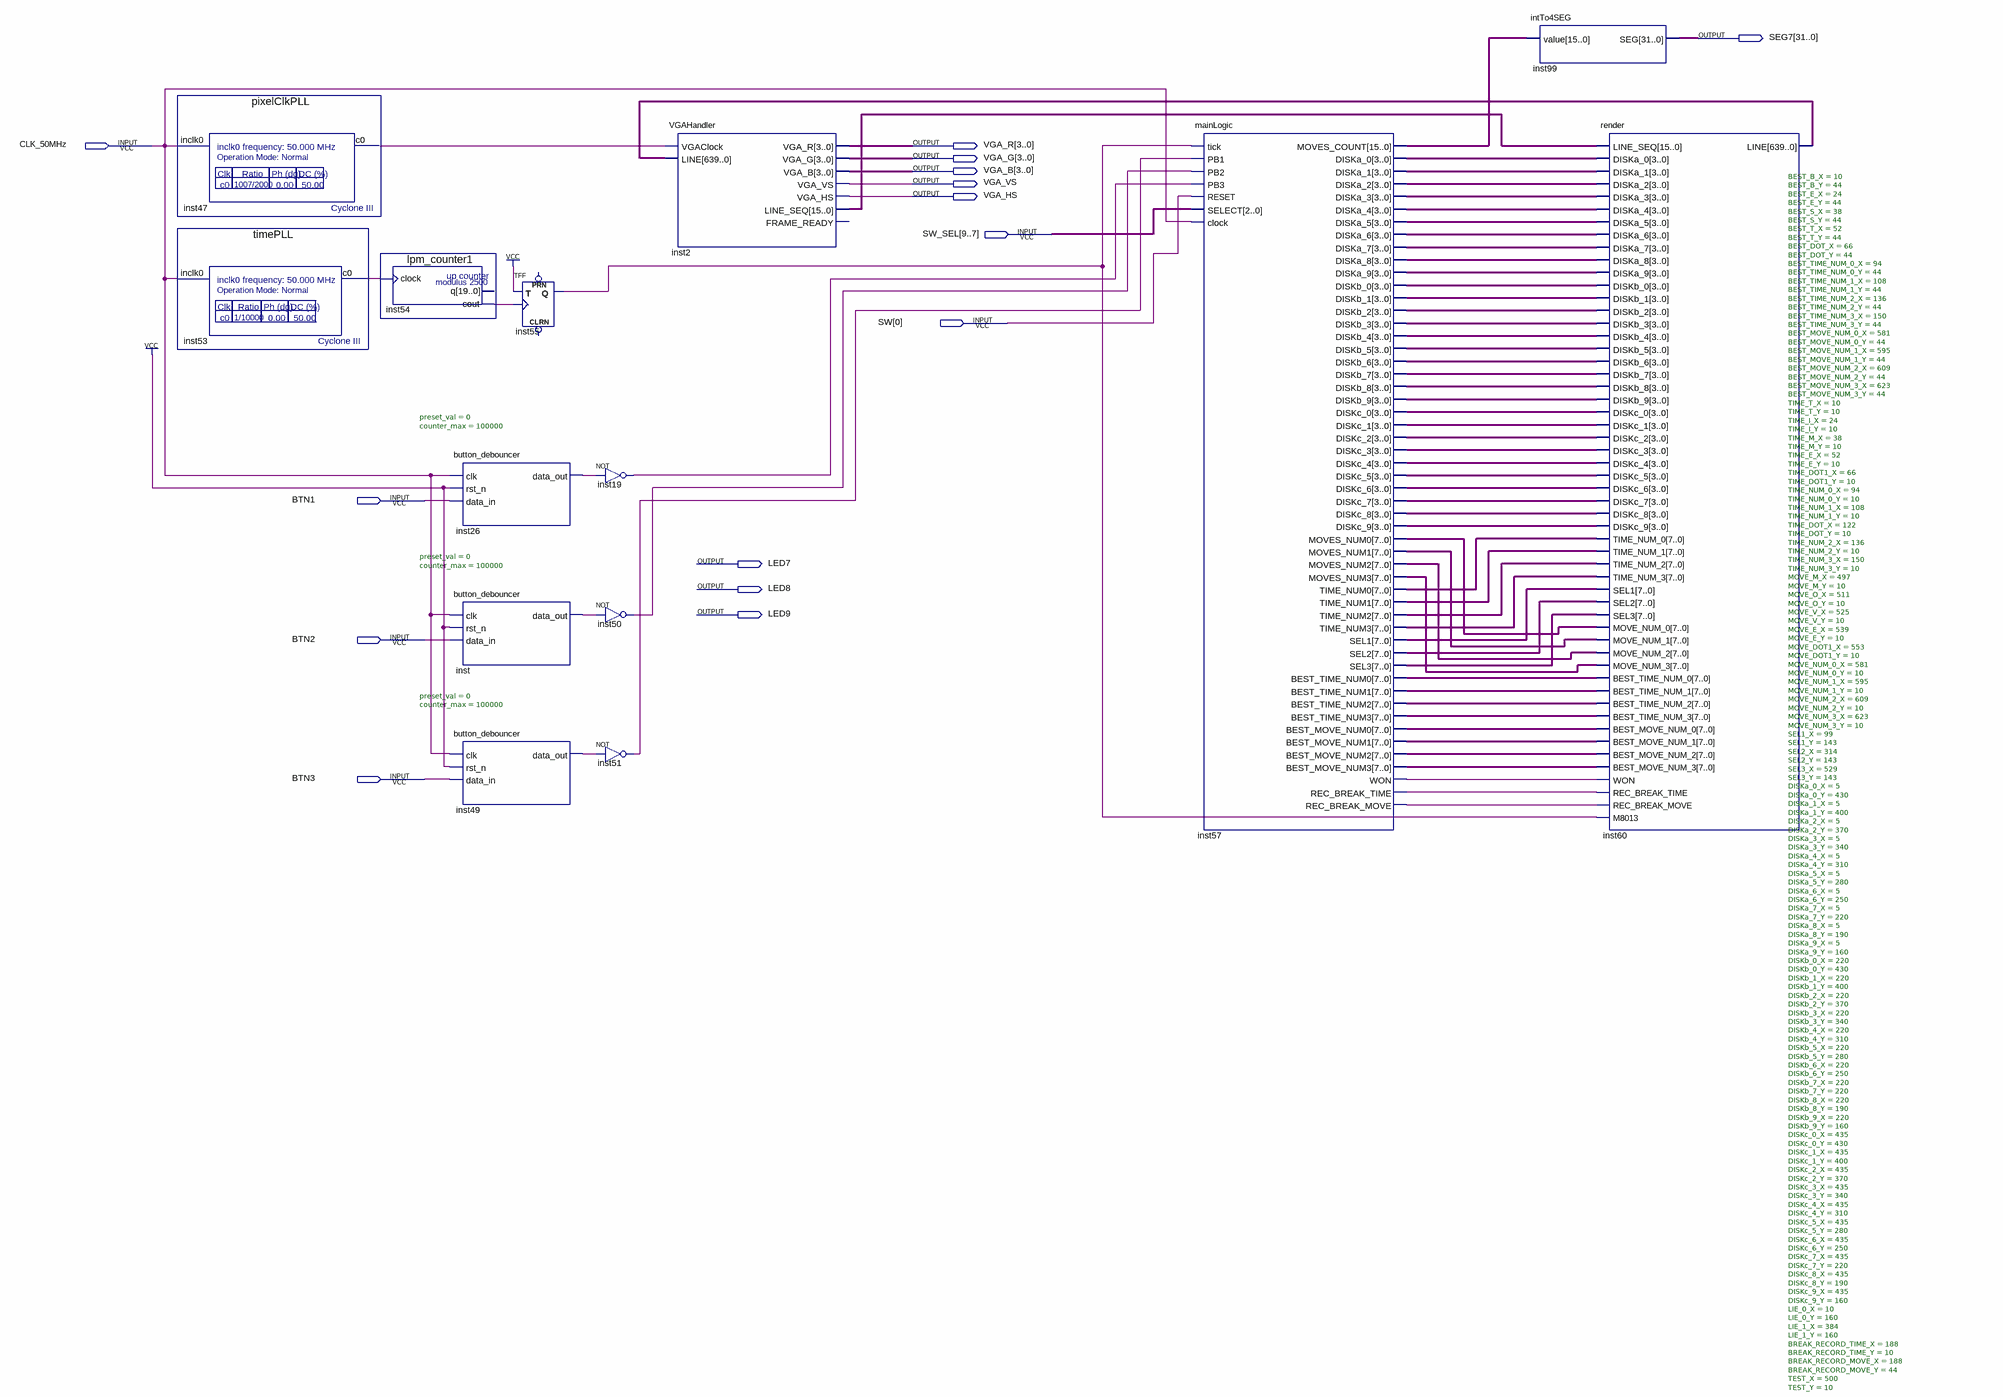
[diagram p0: schematic sheet]
// Quartus schematic main.bdf as structural Verilog: 14 symbols, 15 pins
module main (
  input  CLK_50MHz,
  input  [9:7] SW_SEL,
  input  [0:0] SW,
  input  BTN1,
  input  BTN2,
  input  BTN3,
  output [31:0] SEG7,
  output [3:0] VGA_R,
  output [3:0] VGA_G,
  output [3:0] VGA_B,
  output VGA_VS,
  output VGA_HS,
  output LED7,
  output LED8,
  output LED9
);

  wire inst19_out, inst26_data_out, inst47_c0, inst49_data_out, inst50_out, inst51_out, inst53_c0,
       inst54_cout, inst55_q, inst57_rec_break_move, inst57_rec_break_time, inst57_won, inst_data_out;
  wire [3:0] inst57_diska_0, inst57_diska_1, inst57_diska_2, inst57_diska_3, inst57_diska_4, inst57_diska_5,
       inst57_diska_6, inst57_diska_7, inst57_diska_8, inst57_diska_9, inst57_diskb_0, inst57_diskb_1,
       inst57_diskb_2, inst57_diskb_3, inst57_diskb_4, inst57_diskb_5, inst57_diskb_6, inst57_diskb_7,
       inst57_diskb_8, inst57_diskb_9, inst57_diskc_0, inst57_diskc_1, inst57_diskc_2, inst57_diskc_3,
       inst57_diskc_4, inst57_diskc_5, inst57_diskc_6, inst57_diskc_7, inst57_diskc_8, inst57_diskc_9;
  wire [7:0] inst57_best_move_num0, inst57_best_move_num1, inst57_best_move_num2, inst57_best_move_num3,
       inst57_best_time_num0, inst57_best_time_num1, inst57_best_time_num2, inst57_best_time_num3,
       inst57_moves_num0, inst57_moves_num1, inst57_moves_num2, inst57_moves_num3, inst57_sel1, inst57_sel2,
       inst57_sel3, inst57_time_num0, inst57_time_num1, inst57_time_num2, inst57_time_num3;
  wire [15:0] inst2_line_seq, inst57_moves_count;
  wire [639:0] inst60_line;

  pixelClkPLL inst47 (.inclk0(CLK_50MHz), .c0(inst47_c0));
  timePLL inst53 (.inclk0(CLK_50MHz), .c0(inst53_c0));
  lpm_counter1 inst54 (.clock(inst53_c0), .cout(inst54_cout));  // open: q
  button_debouncer #(.preset_val(0), .counter_max(100000)) inst26 (
    .clk(CLK_50MHz), .rst_n(1'b1), .data_in(BTN1), .data_out(inst26_data_out));
  button_debouncer #(.preset_val(0), .counter_max(100000)) inst (
    .clk(CLK_50MHz), .rst_n(1'b1), .data_in(BTN2), .data_out(inst_data_out));
  button_debouncer #(.preset_val(0), .counter_max(100000)) inst49 (
    .clk(CLK_50MHz), .rst_n(1'b1), .data_in(BTN3), .data_out(inst49_data_out));
  TFF inst55 (.T(1'b1), .CLK(inst54_cout), .Q(inst55_q));  // open: PRN, CLRN
  not inst19 (inst19_out, inst26_data_out);
  not inst50 (inst50_out, inst_data_out);
  not inst51 (inst51_out, inst49_data_out);
  VGAHandler inst2 (
    .VGAClock(inst47_c0), .LINE(inst60_line), .VGA_R(VGA_R), .VGA_G(VGA_G), .VGA_B(VGA_B), .VGA_VS(VGA_VS),
    .VGA_HS(VGA_HS), .LINE_SEQ(inst2_line_seq));  // open: FRAME_READY
  mainLogic inst57 (
    .tick(inst55_q), .PB1(inst51_out), .PB2(inst50_out), .PB3(inst19_out), .RESET(SW[0]), .SELECT(SW_SEL),
    .clock(CLK_50MHz), .MOVES_COUNT(inst57_moves_count), .DISKa_0(inst57_diska_0), .DISKa_1(inst57_diska_1),
    .DISKa_2(inst57_diska_2), .DISKa_3(inst57_diska_3), .DISKa_4(inst57_diska_4), .DISKa_5(inst57_diska_5),
    .DISKa_6(inst57_diska_6), .DISKa_7(inst57_diska_7), .DISKa_8(inst57_diska_8), .DISKa_9(inst57_diska_9),
    .DISKb_0(inst57_diskb_0), .DISKb_1(inst57_diskb_1), .DISKb_2(inst57_diskb_2), .DISKb_3(inst57_diskb_3),
    .DISKb_4(inst57_diskb_4), .DISKb_5(inst57_diskb_5), .DISKb_6(inst57_diskb_6), .DISKb_7(inst57_diskb_7),
    .DISKb_8(inst57_diskb_8), .DISKb_9(inst57_diskb_9), .DISKc_0(inst57_diskc_0), .DISKc_1(inst57_diskc_1),
    .DISKc_2(inst57_diskc_2), .DISKc_3(inst57_diskc_3), .DISKc_4(inst57_diskc_4), .DISKc_5(inst57_diskc_5),
    .DISKc_6(inst57_diskc_6), .DISKc_7(inst57_diskc_7), .DISKc_8(inst57_diskc_8), .DISKc_9(inst57_diskc_9),
    .MOVES_NUM0(inst57_moves_num0), .MOVES_NUM1(inst57_moves_num1), .MOVES_NUM2(inst57_moves_num2),
    .MOVES_NUM3(inst57_moves_num3), .TIME_NUM0(inst57_time_num0), .TIME_NUM1(inst57_time_num1),
    .TIME_NUM2(inst57_time_num2), .TIME_NUM3(inst57_time_num3), .SEL1(inst57_sel1), .SEL2(inst57_sel2),
    .SEL3(inst57_sel3), .BEST_TIME_NUM0(inst57_best_time_num0), .BEST_TIME_NUM1(inst57_best_time_num1),
    .BEST_TIME_NUM2(inst57_best_time_num2), .BEST_TIME_NUM3(inst57_best_time_num3),
    .BEST_MOVE_NUM0(inst57_best_move_num0), .BEST_MOVE_NUM1(inst57_best_move_num1),
    .BEST_MOVE_NUM2(inst57_best_move_num2), .BEST_MOVE_NUM3(inst57_best_move_num3), .WON(inst57_won),
    .REC_BREAK_TIME(inst57_rec_break_time), .REC_BREAK_MOVE(inst57_rec_break_move));
  intTo4SEG inst99 (.value(inst57_moves_count), .SEG(SEG7));
  render #(.BEST_B_X(10), .BEST_B_Y(44), .BEST_E_X(24), .BEST_E_Y(44), .BEST_S_X(38), .BEST_S_Y(44), .BEST_T_X(52), .BEST_T_Y(44), .BEST_DOT_X(66), .BEST_DOT_Y(44), .BEST_TIME_NUM_0_X(94), .BEST_TIME_NUM_0_Y(44), .BEST_TIME_NUM_1_X(108), .BEST_TIME_NUM_1_Y(44), .BEST_TIME_NUM_2_X(136), .BEST_TIME_NUM_2_Y(44), .BEST_TIME_NUM_3_X(150), .BEST_TIME_NUM_3_Y(44), .BEST_MOVE_NUM_0_X(581), .BEST_MOVE_NUM_0_Y(44), .BEST_MOVE_NUM_1_X(595), .BEST_MOVE_NUM_1_Y(44), .BEST_MOVE_NUM_2_X(609), .BEST_MOVE_NUM_2_Y(44), .BEST_MOVE_NUM_3_X(623), .BEST_MOVE_NUM_3_Y(44), .TIME_T_X(10), .TIME_T_Y(10), .TIME_I_X(24), .TIME_I_Y(10), .TIME_M_X(38), .TIME_M_Y(10), .TIME_E_X(52), .TIME_E_Y(10), .TIME_DOT1_X(66), .TIME_DOT1_Y(10), .TIME_NUM_0_X(94), .TIME_NUM_0_Y(10), .TIME_NUM_1_X(108), .TIME_NUM_1_Y(10), .TIME_DOT_X(122), .TIME_DOT_Y(10), .TIME_NUM_2_X(136), .TIME_NUM_2_Y(10), .TIME_NUM_3_X(150), .TIME_NUM_3_Y(10), .MOVE_M_X(497), .MOVE_M_Y(10), .MOVE_O_X(511), .MOVE_O_Y(10), .MOVE_V_X(525), .MOVE_V_Y(10), .MOVE_E_X(539), .MOVE_E_Y(10), .MOVE_DOT1_X(553), .MOVE_DOT1_Y(10), .MOVE_NUM_0_X(581), .MOVE_NUM_0_Y(10), .MOVE_NUM_1_X(595), .MOVE_NUM_1_Y(10), .MOVE_NUM_2_X(609), .MOVE_NUM_2_Y(10), .MOVE_NUM_3_X(623), .MOVE_NUM_3_Y(10), .SEL1_X(99), .SEL1_Y(143), .SEL2_X(314), .SEL2_Y(143), .SEL3_X(529), .SEL3_Y(143), .DISKa_0_X(5), .DISKa_0_Y(430), .DISKa_1_X(5), .DISKa_1_Y(400), .DISKa_2_X(5), .DISKa_2_Y(370), .DISKa_3_X(5), .DISKa_3_Y(340), .DISKa_4_X(5), .DISKa_4_Y(310), .DISKa_5_X(5), .DISKa_5_Y(280), .DISKa_6_X(5), .DISKa_6_Y(250), .DISKa_7_X(5), .DISKa_7_Y(220), .DISKa_8_X(5), .DISKa_8_Y(190), .DISKa_9_X(5), .DISKa_9_Y(160), .DISKb_0_X(220), .DISKb_0_Y(430), .DISKb_1_X(220), .DISKb_1_Y(400), .DISKb_2_X(220), .DISKb_2_Y(370), .DISKb_3_X(220), .DISKb_3_Y(340), .DISKb_4_X(220), .DISKb_4_Y(310), .DISKb_5_X(220), .DISKb_5_Y(280), .DISKb_6_X(220), .DISKb_6_Y(250), .DISKb_7_X(220), .DISKb_7_Y(220), .DISKb_8_X(220), .DISKb_8_Y(190), .DISKb_9_X(220), .DISKb_9_Y(160), .DISKc_0_X(435), .DISKc_0_Y(430), .DISKc_1_X(435), .DISKc_1_Y(400), .DISKc_2_X(435), .DISKc_2_Y(370), .DISKc_3_X(435), .DISKc_3_Y(340), .DISKc_4_X(435), .DISKc_4_Y(310), .DISKc_5_X(435), .DISKc_5_Y(280), .DISKc_6_X(435), .DISKc_6_Y(250), .DISKc_7_X(435), .DISKc_7_Y(220), .DISKc_8_X(435), .DISKc_8_Y(190), .DISKc_9_X(435), .DISKc_9_Y(160), .LIE_0_X(10), .LIE_0_Y(160), .LIE_1_X(384), .LIE_1_Y(160), .BREAK_RECORD_TIME_X(188), .BREAK_RECORD_TIME_Y(10), .BREAK_RECORD_MOVE_X(188), .BREAK_RECORD_MOVE_Y(44), .TEST_X(500), .TEST_Y(10)) inst60 (
    .LINE_SEQ(inst2_line_seq), .DISKa_0(inst57_diska_0), .DISKa_1(inst57_diska_1), .DISKa_2(inst57_diska_2),
    .DISKa_3(inst57_diska_3), .DISKa_4(inst57_diska_4), .DISKa_5(inst57_diska_5), .DISKa_6(inst57_diska_6),
    .DISKa_7(inst57_diska_7), .DISKa_8(inst57_diska_8), .DISKa_9(inst57_diska_9), .DISKb_0(inst57_diskb_0),
    .DISKb_1(inst57_diskb_1), .DISKb_2(inst57_diskb_2), .DISKb_3(inst57_diskb_3), .DISKb_4(inst57_diskb_4),
    .DISKb_5(inst57_diskb_5), .DISKb_6(inst57_diskb_6), .DISKb_7(inst57_diskb_7), .DISKb_8(inst57_diskb_8),
    .DISKb_9(inst57_diskb_9), .DISKc_0(inst57_diskc_0), .DISKc_1(inst57_diskc_1), .DISKc_2(inst57_diskc_2),
    .DISKc_3(inst57_diskc_3), .DISKc_4(inst57_diskc_4), .DISKc_5(inst57_diskc_5), .DISKc_6(inst57_diskc_6),
    .DISKc_7(inst57_diskc_7), .DISKc_8(inst57_diskc_8), .DISKc_9(inst57_diskc_9),
    .TIME_NUM_0(inst57_time_num0), .TIME_NUM_1(inst57_time_num1), .TIME_NUM_2(inst57_time_num2),
    .TIME_NUM_3(inst57_time_num3), .SEL1(inst57_sel1), .SEL2(inst57_sel2), .SEL3(inst57_sel3),
    .MOVE_NUM_0(inst57_moves_num0), .MOVE_NUM_1(inst57_moves_num1), .MOVE_NUM_2(inst57_moves_num2),
    .MOVE_NUM_3(inst57_moves_num3), .BEST_TIME_NUM_0(inst57_best_time_num0),
    .BEST_TIME_NUM_1(inst57_best_time_num1), .BEST_TIME_NUM_2(inst57_best_time_num2),
    .BEST_TIME_NUM_3(inst57_best_time_num3), .BEST_MOVE_NUM_0(inst57_best_move_num0),
    .BEST_MOVE_NUM_1(inst57_best_move_num1), .BEST_MOVE_NUM_2(inst57_best_move_num2),
    .BEST_MOVE_NUM_3(inst57_best_move_num3), .WON(inst57_won), .REC_BREAK_TIME(inst57_rec_break_time),
    .REC_BREAK_MOVE(inst57_rec_break_move), .M8013(inst55_q), .LINE(inst60_line));
endmodule
